# Altium schematic sheet DCDC-EPOT.SchDoc
size A4; SheetNumber: 3; SheetTotal: 5
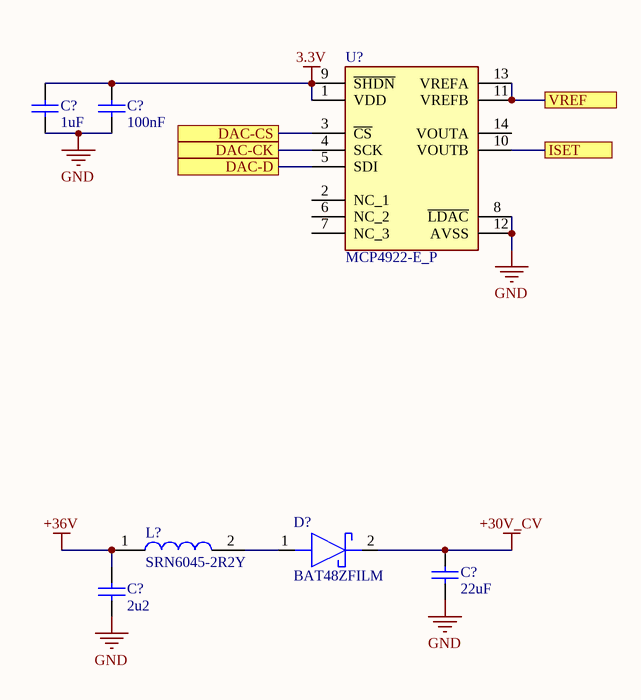
[diagram p0: DCDC-EPOT.SchDoc]

## Parts
(Parts that share a designator on the sheet are numbered #1, #2 ... from top to bottom, then left to right.)
C?#1  value 1uF  [Cap_0603]  (hidden comment: Cap)
C?#2  value 100nF  [Cap_0603]  (hidden comment: Cap)
C?#3  value 2u2  [Cap_0603]  (hidden comment: Cap)
C?#4  value 22uF  [Cap_0603]  (hidden comment: Cap)
D?  BAT48ZFILM  [BAT48ZFILM]
L?  SRN6045-2R2Y  [SRN6045_1]
U?  MCP4922-E_P  [DIP794W56P254L1905H432Q14N]

## Ports
DAC-CK, DAC-CS, DAC-D, ISET, VREF

## Nets
3.3V: C?#1.1 C?#2.1 U?.1(VDD) U?.9(~{SHDN})
+30V_CV: C?#4.2 D?.2(K)
+36V: C?#3.1 L?.1
GND: C?#1.2 C?#2.2 C?#3.2 C?#4.1 U?.8(~{LDAC}) U?.12(AVSS)
DAC-CK: U?.4(SCK) ; port DAC-CK
DAC-CS: U?.3(~{CS}) ; port DAC-CS
DAC-D: U?.5(SDI) ; port DAC-D
ISET: U?.10(VOUTB) ; port ISET
VREF: U?.11(VREFB) U?.13(VREFA) ; port VREF
NetD?_1: D?.1(A) L?.2

Not connected (* = marked no-connect by the designer): U? 2(NC_1) 6(NC_2) 7(NC_3) 14(VOUTA)

## Library data of the parts
C?#1-C?#4 = Cap: Capacitor; Published: 8-Jun-2000; LatestRevisionDate: 17-Jul-2002; LatestRevisionNote: Re-released for DXP Platform.; PackageReference: RAD-0.3; Publisher: Altium Limited; PackageDescription: Radial Cap, Thru-Hole; 2 Leads; 0.3 in Pin Spacing
D? = BAT48ZFILM: Schottky Diode; Manufacturer_Name: STMicroelectronics; Datasheet Link: https://altium.componentsearchengine.com/Datasheets/2/BAT48ZFILM.pdf; Height: 1.45mm; Manufacturer_Part_Number: BAT48ZFILM; Mouser Part Number: 511-BAT48ZFILM; Mouser Price/Stock: https://www.mouser.co.uk/ProductDetail/STMicroelectronics/BAT48ZFILM?qs=jZi1jxfVU97drMZAC9JWhA%3D%3D; Arrow Part Number: BAT48ZFILM; Arrow Price/Stock: https://www.arrow.com/en/products/bat48zfilm/stmicroelectronics?region=europe; ComponentLink1Description: Datasheet; ComponentLink1URL: https://altium.componentsearchengine.com/Datasheets/2/BAT48ZFILM.pdf
L? = SRN6045-2R2Y: Inductor; Manufacturer_Name: Bourns; Datasheet Link: https://www.bourns.com/docs/Product-Datasheets/SRN6045.pdf; Manufacturer_Part_Number: SRN6045-2R2Y; Mouser Part Number: 652-SRN6045-2R2Y; Mouser Price/Stock: https://www.mouser.co.uk/ProductDetail/Bourns/SRN6045-2R2Y?qs=opBjA1TV903BwygMAGUj4g%3D%3D; Arrow Part Number: SRN6045-2R2Y; Arrow Price/Stock: https://www.arrow.com/en/products/srn6045-2r2y/bourns?region=nac
U? = MCP4922-E_P: Integrated Circuit; Manufacturer_Name: Microchip; Manufacturer_Part_Number: MCP4922-E/P; Datasheet Link: http://componentsearchengine.com/Datasheets/3/MCP4922-E_P.pdf; Height: 4.32mm; Mouser Part Number: 579-MCP4922-E/P; Mouser Price/Stock: https://www.mouser.co.uk/ProductDetail/Microchip-Technology/MCP4922-E-P?qs=0R2K%2FH4DmMMzbkgef7lO6A%3D%3D; Arrow Part Number: MCP4922-E/P; Arrow Price/Stock: https://www.arrow.com/en/products/mcp4922-ep/microchip-technology?region=nac